# Altium project MAX78000_template.PrjPcb
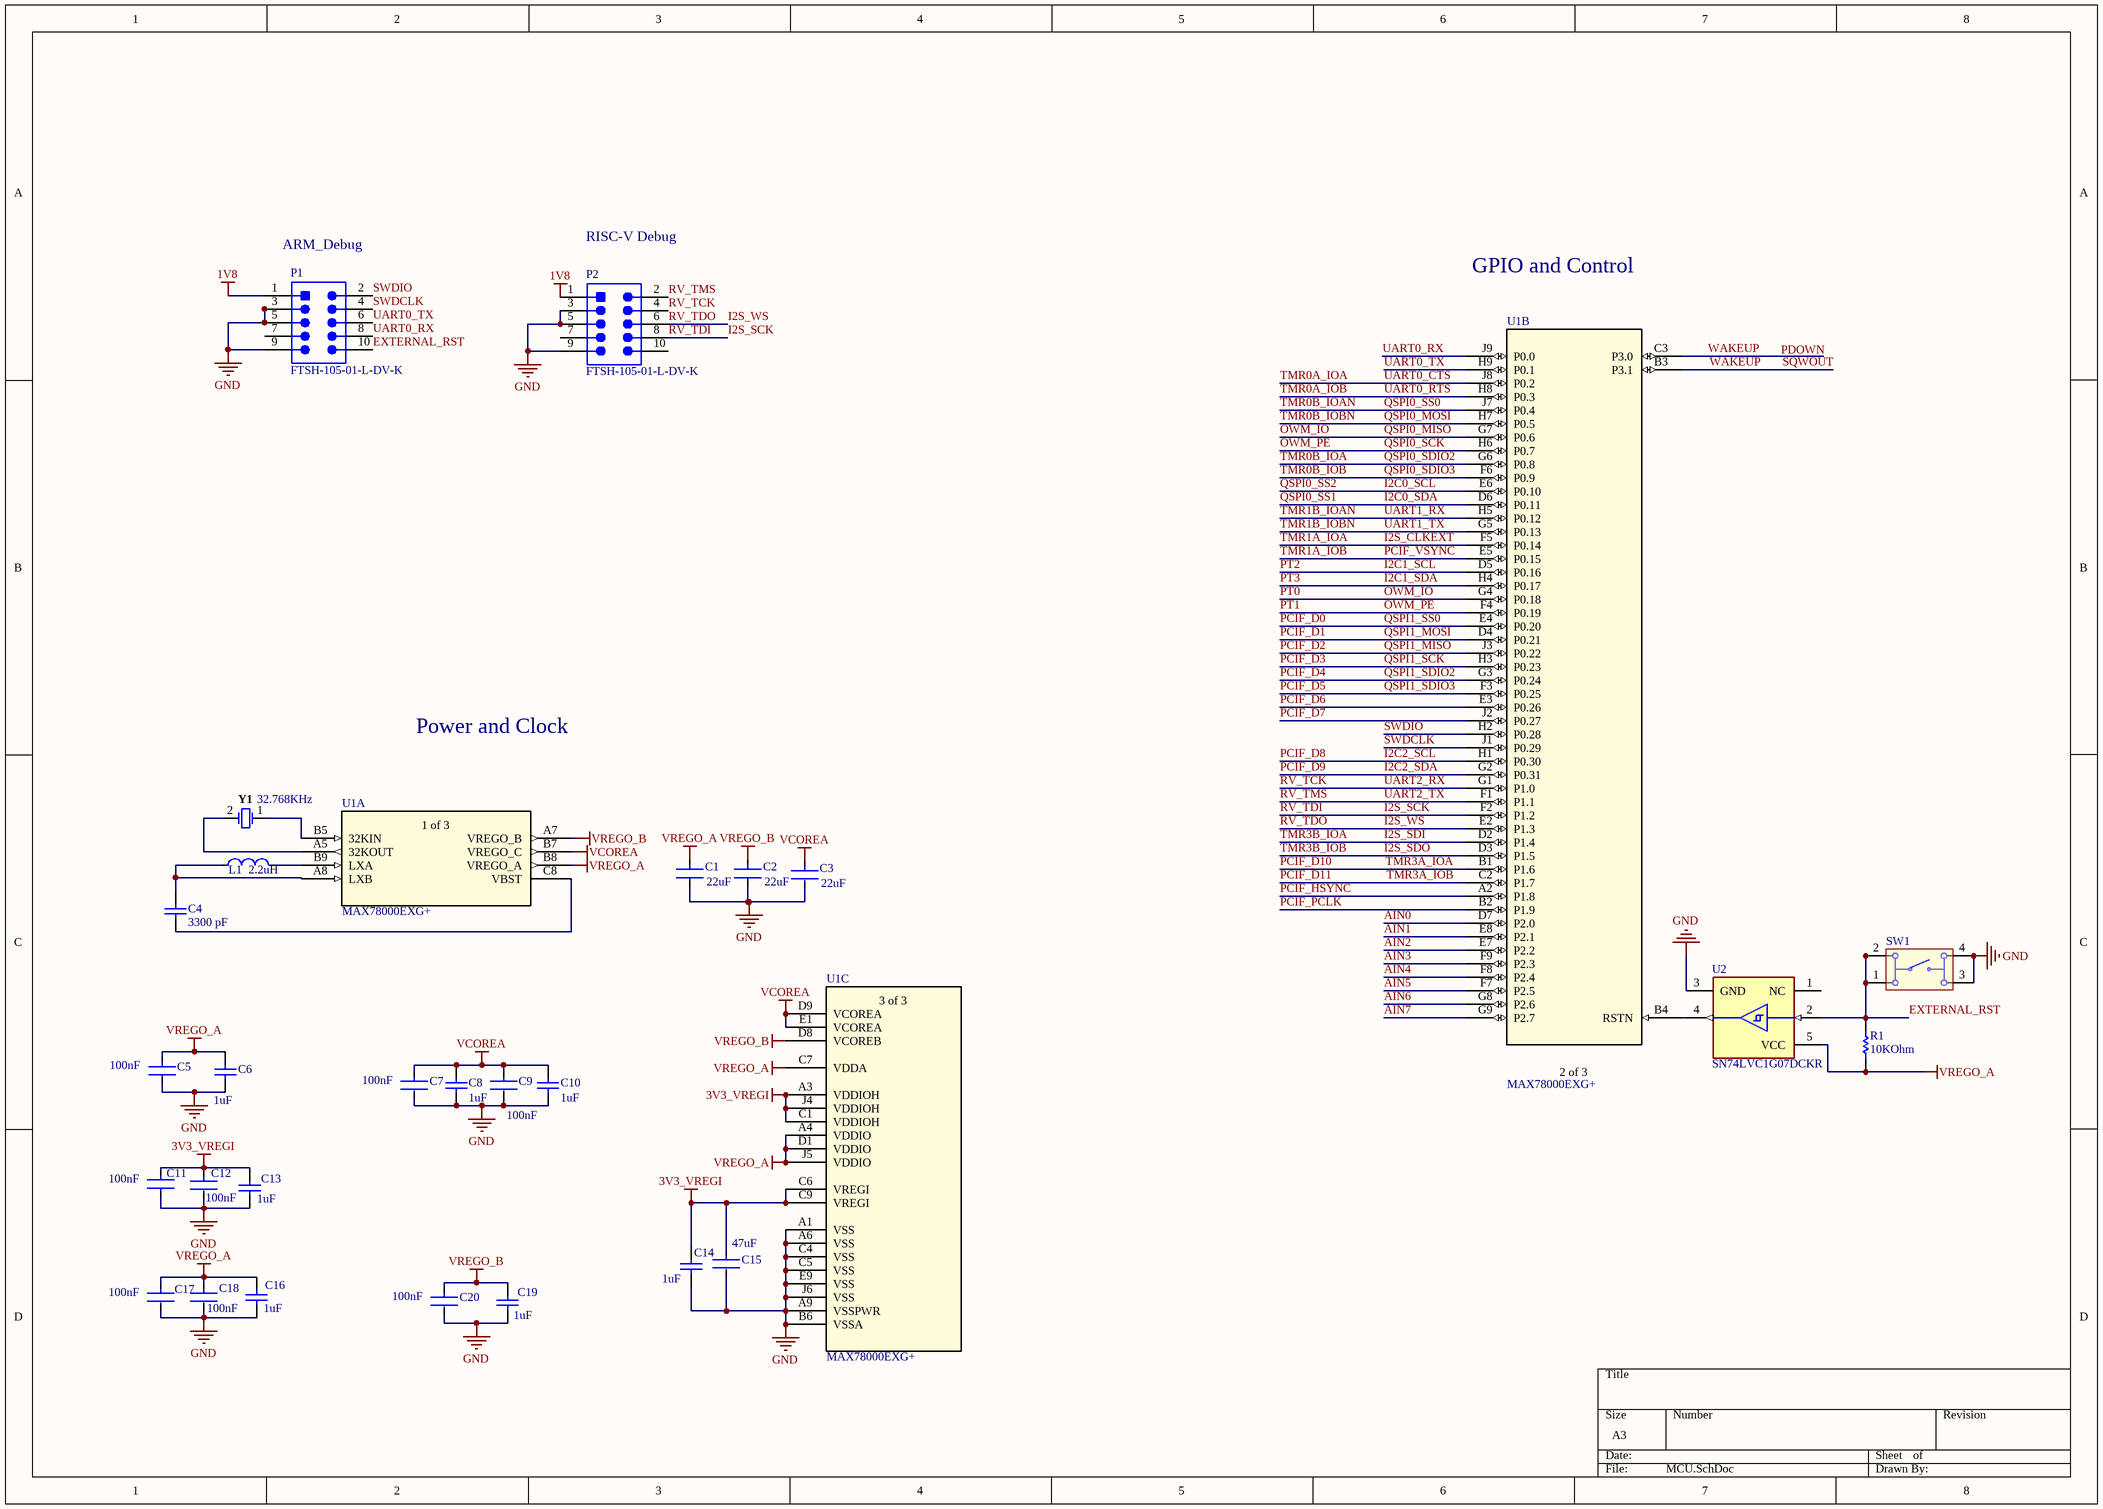
[diagram p0: MCU.SchDoc]
1 sheet, 28 parts. Net scope: global (net labels, ports and power ports of the same name join across sheets).
Board file: PCB1.PcbDoc

## Sheet MCU.SchDoc
size A3; SheetNumber: 1; SheetTotal: 1

### Parts
C1  Capacitance: 22uF  [FP-CL10-IPC_A]  (hidden comment: CL10A226MO7JZNC)
C2  Capacitance: 22uF  [FP-CL10-IPC_A]  (hidden comment: CL10A226MO7JZNC)
C3  Capacitance: 22uF  [FP-CL10-IPC_A]  (hidden comment: CL10A226MO7JZNC)
C4  value 3300 pF  [CAPC1005X55X25ML05T10]  (hidden comment: GRM155R71H332KA01D)
C5  Capacitance: 100nF  [FP-GRM033-0_03-MFG]  (hidden comment: GRM033R61C104KE14D)
C6  value 1uF  [CAPC1005X60X30LL05T10]  (hidden comment: C0402C105K8PAC7867)
C7  Capacitance: 100nF  [FP-GRM033-0_03-MFG]  (hidden comment: GRM033R61C104KE14D)
C8  value 1uF  [CAPC1005X60X30LL05T10]  (hidden comment: C0402C105K8PAC7867)
C9  Capacitance: 100nF  [FP-GRM033-0_03-MFG]  (hidden comment: GRM033R61C104KE14D)
C10  value 1uF  [CAPC1005X60X30LL05T10]  (hidden comment: C0402C105K8PAC7867)
C11  Capacitance: 100nF  [FP-GRM033-0_03-MFG]  (hidden comment: GRM033R61C104KE14D)
C12  Capacitance: 100nF  [FP-GRM033-0_03-MFG]  (hidden comment: GRM033R61C104KE14D)
C13  value 1uF  [CAPC1005X60X30LL05T10]  (hidden comment: C0402C105K8PAC7867)
C14  value 1uF  [CAPC1005X60X30LL05T10]  (hidden comment: C0402C105K8PAC7867)
C15  Capacitance: 47uF  [FP-GRM21B-0_2-e0_2_0_7-IPC_B]  (hidden comment: GRM21BR61A476ME15K)
C16  value 1uF  [CAPC1005X60X30LL05T10]  (hidden comment: C0402C105K8PAC7867)
C17  Capacitance: 100nF  [FP-GRM033-0_03-MFG]  (hidden comment: GRM033R61C104KE14D)
C18  Capacitance: 100nF  [FP-GRM033-0_03-MFG]  (hidden comment: GRM033R61C104KE14D)
C19  value 1uF  [CAPC1005X60X30LL05T10]  (hidden comment: C0402C105K8PAC7867)
C20  Capacitance: 100nF  [FP-GRM033-0_03-MFG]  (hidden comment: GRM033R61C104KE14D)
L1  Inductance: 2.2uH  [FP-MLP2012M-IPC_C]  (hidden comment: MLP2012H2R2MT0S1)
P1  FTSH-105-01-L-DV-K  [SMTC-FTSH-105-01-L-DV-K_V]
P2  FTSH-105-01-L-DV-K  [SMTC-FTSH-105-01-L-DV-K_V]
R1  Resistance: 10KOhm  [RESC1609X55X30LL15T15]  (hidden comment: ERJ3EKF1002V)
SW1  430481025816  [430481025816]  (value not drawn)
U1  MAX78000EXG+  [21-0735_MXM]  (parts A,B,C of 3)
U2  SN74LVC1G07DCKR  [FP-DCK0005A-IPC_C]
Y1  Frequency: 32.768KHz  [ABRA-ABS07_A_V]  (hidden comment: ABS07-120-32.768KHZ-T)

### Nets
1V8: P1.1 P2.1
3V3_VREGI: C11.1 C12.1 C13.2 C14.2 C15.1 U1.A3(VDDIOH) U1.C1(VDDIOH) U1.C6(VREGI) U1.C9(VREGI) U1.J4(VDDIOH)
GND: C1.2 C2.2 C3.2 C5.2 C6.1 C7.2 C8.1 C9.2 C10.1 C11.2 C12.2 C13.1 C14.1 C15.2 C16.1 C17.2 C18.2 C19.1 C20.2 P1.3 P1.5 P1.9 P2.3 P2.5 P2.9 SW1.3 SW1.4 U1.A1(VSS) U1.A6(VSS) U1.A9(VSSPWR) U1.B6(VSSA) U1.C4(VSS) U1.C5(VSS) U1.E9(VSS) U1.J6(VSS) U2.3(GND)
VCOREA: C3.1 C7.1 C8.2 C9.1 C10.2 U1.B7(VREGO_C) U1.D9(VCOREA) U1.E1(VCOREA)
VREGO_A: C1.1 C5.1 C6.2 C16.2 C17.1 C18.1 R1.1 U1.A4(VDDIO) U1.B8(VREGO_A) U1.C7(VDDA) U1.D1(VDDIO) U1.J5(VDDIO) U2.5(VCC)
VREGO_B: C2.1 C19.2 C20.1 U1.A7(VREGO_B) U1.D8(VCOREB)
AIN0: U1.D7(P2.0)
AIN1: U1.E8(P2.1)
AIN2: U1.E7(P2.2)
AIN3: U1.F9(P2.3)
AIN4: U1.F8(P2.4)
AIN5: U1.F7(P2.5)
AIN6: U1.G8(P2.6)
AIN7: U1.G9(P2.7)
EXTERNAL_RST: P1.10 R1.2 SW1.1 SW1.2 U2.2(A)
I2C0_SCL: U1.E6(P0.10)  [also labelled QSPI0_SS2]
I2C0_SDA: U1.D6(P0.11)  [also labelled QSPI0_SS1]
I2C1_SCL: U1.D5(P0.16)  [also labelled PT2]
I2C1_SDA: U1.H4(P0.17)  [also labelled PT3]
I2C2_SCL: U1.H1(P0.30)  [also labelled PCIF_D8]
I2C2_SDA: U1.G2(P0.31)  [also labelled PCIF_D9]
I2S_CLKEXT: U1.F5(P0.14)  [also labelled TMR1A_IOA]
I2S_SCK: P2.8 U1.F2(P1.2)  [also labelled RV_TDI]
I2S_SDI: U1.D2(P1.4)  [also labelled TMR3B_IOA]
I2S_SDO: U1.D3(P1.5)  [also labelled TMR3B_IOB]
I2S_WS: P2.6 U1.E2(P1.3)  [also labelled RV_TDO]
OWM_IO: U1.G4(P0.18) U1.G7(P0.6)  [also labelled PT0, QSPI0_MISO]
OWM_PE: U1.F4(P0.19) U1.H6(P0.7)  [also labelled PT1, QSPI0_SCK]
PCIF_D0: U1.E4(P0.20)  [also labelled QSPI1_SS0]
PCIF_D1: U1.D4(P0.21)  [also labelled QSPI1_MOSI]
PCIF_D2: U1.J3(P0.22)  [also labelled QSPI1_MISO]
PCIF_D3: U1.H3(P0.23)  [also labelled QSPI1_SCK]
PCIF_D4: U1.G3(P0.24)  [also labelled QSPI1_SDIO2]
PCIF_D5: U1.F3(P0.25)  [also labelled QSPI1_SDIO3]
PCIF_D6: U1.E3(P0.26)
PCIF_D7: U1.J2(P0.27)
PCIF_D10: U1.B1(P1.6)  [also labelled TMR3A_IOA]
PCIF_D11: U1.C2(P1.7)  [also labelled TMR3A_IOB]
PCIF_HSYNC: U1.A2(P1.8)
PCIF_PCLK: U1.B2(P1.9)
PCIF_VSYNC: U1.E5(P0.15)  [also labelled TMR1A_IOB]
QSPI0_MOSI: U1.H7(P0.5)  [also labelled TMR0B_IOBN]
QSPI0_SDIO2: U1.G6(P0.8)  [also labelled TMR0B_IOA]
QSPI0_SDIO3: U1.F6(P0.9)  [also labelled TMR0B_IOB]
QSPI0_SS0: U1.J7(P0.4)  [also labelled TMR0B_IOAN]
RV_TCK: P2.4 U1.G1(P1.0)  [also labelled UART2_RX]
RV_TMS: P2.2 U1.F1(P1.1)  [also labelled UART2_TX]
SQWOUT: U1.B3(P3.1) U1.C3(P3.0)  [also labelled WAKEUP]
SWDCLK: P1.4 U1.J1(P0.29)
SWDIO: P1.2 U1.H2(P0.28)
TMR0A_IOA: U1.J8(P0.2)  [also labelled UART0_CTS]
TMR0A_IOB: U1.H8(P0.3)  [also labelled UART0_RTS]
TMR1B_IOAN: U1.H5(P0.12)  [also labelled UART1_RX]
TMR1B_IOBN: U1.G5(P0.13)  [also labelled UART1_TX]
UART0_RX: P1.8 U1.J9(P0.0)
UART0_TX: P1.6 U1.H9(P0.1)
NetC4_1: C4.1 U1.C8(VBST)
NetC4_2: C4.2 L1.1 U1.A8(LXB)
NetL1_2: L1.2 U1.B9(LXA)
NetU1_A5: U1.A5(32KOUT) Y1.2
NetU1_B4: U1.B4(RSTN) U2.4(Y)
NetU1_B5: U1.B5(32KIN) Y1.1

Not connected (* = marked no-connect by the designer): P1 7; P2 7 10; U2 1(NC)

### Notes on the sheet
- (near P1) ARM_Debug
- (near P2) RISC-V Debug
- GPIO and Control
- Power and Clock
- Labels drawn without touching a wire or pin: PDOWN
- (in symbol MAX78000EXG+, part A) 1 of 3
- (in symbol MAX78000EXG+, part B) 2 of 3
- (in symbol MAX78000EXG+, part C) 3 of 3

### Library data of the parts
C1-C3 = CMP-13271-002755-1: Cap Ceramic 22uF 16V X5R ±20% Pad SMD 0603 +85°C T/R; Mount: Surface Mount; Packaging: Tape and Reel; Case Code (Imperial): 0603; Max Operating Temperature: 85°C; Case/Package: 0603; Voltage Rating: 16V; Tolerance: 20%; Case Code (Metric): 1608; Min Operating Temperature: -55°C
C4 = CMP-2008-04658-1: Manufacturer: Murata; Part Number: GRM155R71H332KA01D
C5 C7 C9 C11 C12 C17 C18 C20 = CMP-06035-039275-1: Chip Multilayer Ceramic Capacitors for General Purpose, 0201, 0.10uF, X5R, 15%, 10%, 16V; Length: 600um; Dielectric: X5R; Tolerance: 10%; Thickness: 300um; Voltage Rating (DC): 16V; Width: 300um
C6 C8 C10 C13 C14 C16 C19 = CMP-2008-02081-1: Manufacturer: Kemet; Part Number: C0402C105K8PAC7867
C15 = CMP-06035-042633-1: Chip Multilayer Ceramic Capacitors for General Purpose, 0805, 47uF, X5R, 15%, 20%, 10V; Min Operating Temperature: -55°C; Max Operating Temperature: 85°C; Length: 0.079inch; Case Code (Imperial): 0805; Tolerance: 20%; Mount: Surface Mount; Voltage Rating (DC): 10V; Termination: SMD/SMT; Voltage Rating: 10V; Weight: 0.000335oz; Package Quantity: 10000; Dielectric: X5R; Thickness: 0.057inch; Case/Package: 0805; Width: 0.049inch; Case Code (Metric): 2012; Packaging: Tape and Reel
L1 = CMP-08253-000154-1: Shielded Multilayer Inductor 2.2uH ±20% 1000mA 195mΩ SMD 0805; DC Resistance (DCR): 195mR; Core Material: Ferrite; Test Frequency: 2MHz; Current Rating: 1A; Packaging: Tape and Reel; Length: 0.079inch; Tolerance: 20%; Case/Package: 0805; Case Code (Imperial): 0805; Min Operating Temperature: -40°C; Case Code (Metric): 2012; Shielding: Shielded; Mount: Surface Mount; Lead Free: Lead Free; Height - Seated (Max): 0.039inch; Max Operating Temperature: 125°C; RoHS Compliant: Yes; Package Quantity: 4000; Width: 0.049inch
P1 P2 = CMP-2000-05353-1: Male Header, Pitch 1.27 mm, 2 x 5 Position, Height 6.25 mm; Manufacturer: Samtec; Pitch: 0.050"(1.27mm); Other Names: Q3937619; Number of Positions: 10; Mating Products: SFMC-105-L2-S-D-TR-ND / -CONN.05"SURFACE10POSSMT / FLE-105-01-G-DV-TR-ND / -CONNSKT1.27MM10POSDUALSMD / FLE-105-01-G-DV-A-P-ND / -CONNSKT1.27MM10POSDUALSMD / FLE-105-01-G-DV-A-ND / -CONNSKT1.27MM10POSDUALSMD / CLP-105-02-G-D-P-TR-ND / -CONNRCPT10POSDUAL.05"SMD / SAM1155-05-ND / -CONNRCPT10POSDUAL.05"SMD / SAM1154-05-ND / -CONNRCPT10POSDUAL.05"SMD / SAM1153-05-ND / -CONNRCPT10POSDUAL.05"SMD / SAM1226-05-ND / -CONNRCPT.05"10POSDUALSMD; Number of Positions Loaded: All; Connector Type: Header,Unshrouded; Product Training Modules: Board-to-BoardConnectors; Datasheet Version: Rev. ET, 10/1995; Number of Rows: 2; Standard Package: 1; Package Description: Male Header, Pitch 1.27 mm, 2 x 5 Position, Height 5.97 mm, Tail Length 4.32 mm; Contact Finish Thickness: 10µin(0.25µm); Series: FTSH; Termination: Solder; Contact Type: MalePin; Color: Black; Package Reference: FTSH-105-01-L-DV-K; Family: RectangularConnectors-Headers,MalePins; Package URL: http://suddendocs.samtec.com/prints/ftsh-1xx-xx-xxx-dv-xxx-footprint.pdf; Packaging: Tube; Mounting Type: SurfaceMount; Category: Connectors,Interconnects; Datasheet URL: http://suddendocs.samtec.com/prints/ftsh-1xx-xx-xxx-dv-xxx-mkt.pdf; Row Spacing: 0.050"(1.27mm); Manufacturer URL: http://www.samtec.com/; Contact Mating Length: 0.120"(3.05mm); Contact Finish: Gold
R1 = CMP-1012-00623-3: Chip Resistor, 10 KOhm, +/- 1%, 0.1 W, -55 to 155 degC, 0603 (1608 Metric), RoHS, Tape and Reel; Manufacturer: Panasonic; Voltage Rating: 75V; Case\/Package: 0603; Power Rating: 100mW; Temperature Coefficient: 100ppm\/degreesC; Number of Pins: 2; Package Reference: 603; Depth: 0.8mm; Mount: SurfaceMount; Package Description: 2-Pin Surface Mount Device, Body 1.6 x 0.85 mm; Datasheet Version: 02/2017; Length: 1.6mm; Lead Free: LeadFree; Height: 0.45mm; Number of Terminations: 2; Max Power Dissipation: 100mW; Min Operating Temperature: -55degC; Datasheet URL: https://industrial.panasonic.com/cdbs/www-data/pdf/RDA0000/AOA0000C304.pdf; Termination: SMD/SMT; Case Code (Metric): 1608; Case Code (Imperial): 0603; Tolerance: 1%; Max Operating Temperature: 155degC; RoHSCompliant: true; Voltage Rating (DC): 75V; Radiation Hardening: No; Packaging: TapeandReel; Composition: ThickFilm; Mounting Technology: SurfaceMount; Manufacturer URL: http://www.panasonic.com/; Width: 0.031inch; REACH SVHC: NoSVHC; Contact Plating: Tin; Military Standard: Not; Package Quantity: 1
SW1 = CMP-1452-00025-1: WS-TASV SMD Tact Switch 6X6 mm; Manufacturer: Wuerth Elektronik; NoPins: 04; ComponentLink1Description: Manufacturer URL; ComponentLink2Description: Datasheet; PackageReference: 430481025816; ComponentLink2URL: http://katalog.we-online.de/em/datasheet/4304x1.pdf; ComponentLink1URL: http://www.we-online.com; PartNumber: 430481025816
U1 = MAX78000EXG+: No Description Available; Built_By: EMA_April; Vendor: Maxim Integrated Products; SourceLibrary: Add_to_database_2021-03-26; Copyright: Copyright (C) 2018 Accelerated Designs. All rights reserved; Manufacturer_Part_Number: MAX78000EXG+; RefDes: RefDes; Type: DEV
U2 = CMP-0859-00290-4: IC BUFF/DVR NON-INVERT SC70-5; Number of Output Lines: 1; Turn-On Delay Time: 8.3ns; Min Supply Voltage: 1.65V; Polarity: Non-Inverting; Quiescent Current: 10uA; Low Level Output Current: 32mA; Nominal Supply Current: 40mA; Logic Function: Buffer; Max Supply Voltage: 5.5V; Number of Bits: 1; Number of Circuits: 1; Contact Plating: Gold; Max Operating Temperature: 125°C; Package Quantity: 1; Number of Channels: 1; Number of Outputs: 1; Case/Package: SC; Number of Gates: 1; Number of Pins: 5; Radiation Hardening: No; Min Operating Temperature: -40°C; Number of Bits per Element: 1; Lead Free: Lead Free; High Level Output Current: 32mA; Number of Input Lines: 1; Number of Inputs: 1; Propagation Delay: 8.3ns; Number of Elements: 1; Packaging: Tape and Reel; Mount: Surface Mount; Termination: SMD/SMT; REACH SVHC: No SVHC
Y1 = CMP-2000-07587-1: Tuning Fork Crystal, 32.768 KHz, +/- 20 ppm, -40 to 85 degC, 2-Pin SMD, RoHS, Tape and Reel; Manufacturer: Abracon; Case\/Package: SMD/SMT; Series Resistance: 60KOhm; Frequency Tolerance: 20ppm; Load Capacitance: 6pF; ESR (Equivalent Series Resistance): 55KOhm; Max Operating Temperature: 85degC; Width: 0.061inch; Radiation Hardening: No; Lead Free: LeadFree; RoHSCompliant: True; Depth: 1.5mm; Datasheet URL: http://www.abracon.com/Resonators/ABS07-120-32.768kHz-T.pdf; Termination: SMD/SMT; Manufacturer URL: http://www.abracon.com/; Package Quantity: 3000; Packaging: TapeandReel; Number of Pins: 2; Height: 0.035inch; Package Description: 2-Pin Surface Mount Device, Body 3.2 x 1.5 mm; Package Reference: ABS07; Mount: SurfaceMount; Tolerance: 20ppm; Mounting Technology: SurfaceMount; REACH SVHC: NoSVHC; Datasheet Version: 11/2014; Length: 3.2mm; Min Operating Temperature: -40degC